# Altium schematic sheet Sheet3.SchDoc
size A4
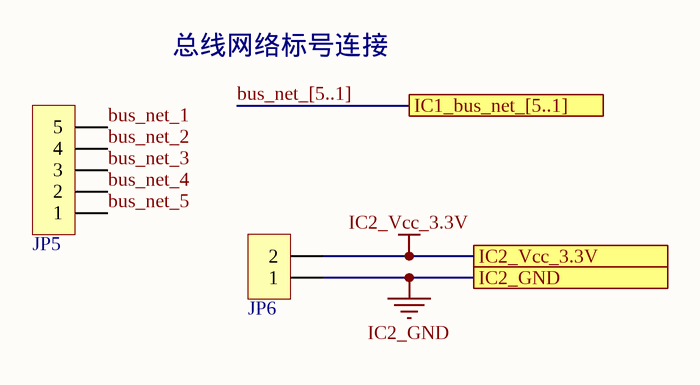
[diagram p0: Sheet3.SchDoc]

## Parts
JP5  HDR-1X5  [HDR2.54-LI-5P]  (value not drawn)
JP6  HDR-1X2  [HDR2.54-LI-2P]  (value not drawn)

## Ports
IC1_bus_net_[5..1], IC2_GND, IC2_Vcc_3.3V

## Nets
IC2_GND: JP6.1 ; port IC2_GND
IC2_Vcc_3.3V: JP6.2 ; port IC2_Vcc_3.3V
bus_net_1: JP5.5
bus_net_2: JP5.4
bus_net_3: JP5.3
bus_net_4: JP5.2
bus_net_5: JP5.1

## Buses and harness runs
bus bus_net_[5..1] = port IC1_bus_net_[5..1]

## Notes on the sheet
- 总线网络标号连接

## Library data of the parts
JP5 = Header 5: 5P接插件; 版权归属: 源创客; BOM名称: 5P接插件; 学习资源: www.ooocke.com
JP6 = Header 2: 2P接插件; 版权归属: 源创客; BOM名称: 2P接插件; 学习资源: www.ooocke.com